# EAGLE schematic zdrive (EAGLE 9.6.2)
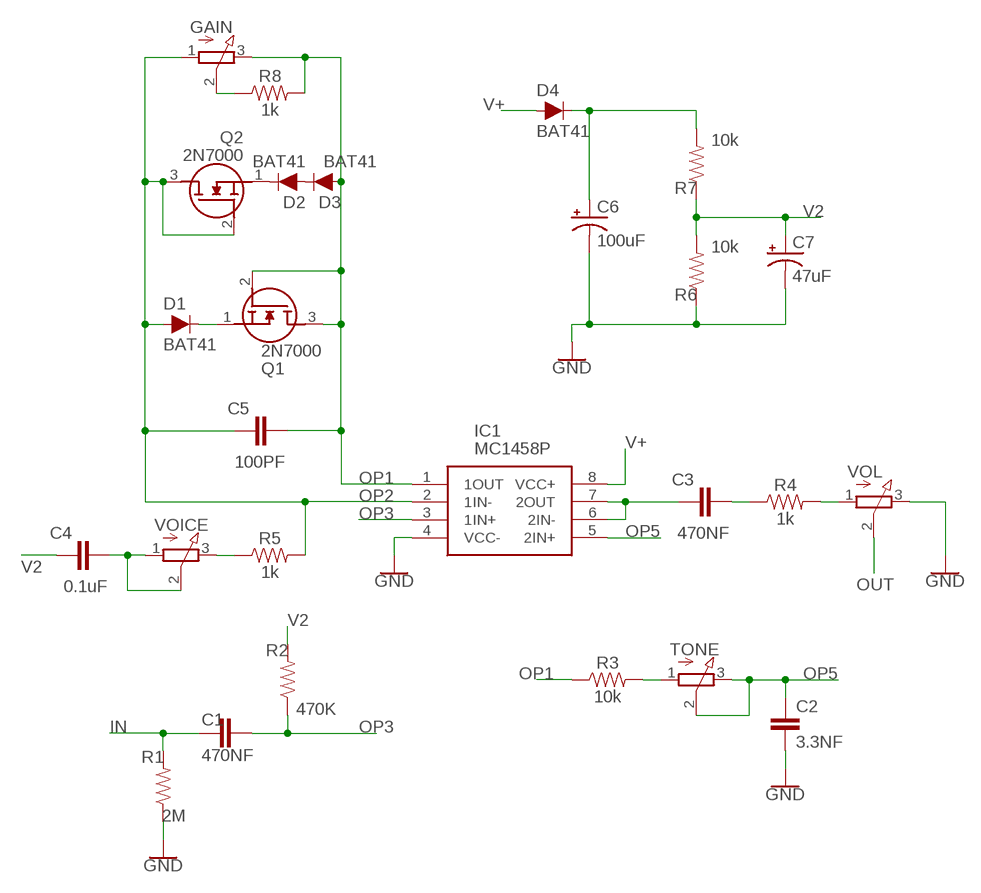
[diagram p0: schematic, sheet 1]

## Parts
C1  470NF  [CAP-PTH-SMALL-KIT]
C2  3.3NF  [CAP-PTH-SMALL-KIT]
C3  470NF  [CAP-PTH-SMALL-KIT]
C4  0.1uF  0.1UF-KIT-EZ-50V-20%  [CAP-PTH-SMALL-KIT]
C5  100PF  [CAP-PTH-SMALL-KIT]
C6  100uF  100UF-POLAR-RADIAL-2.5MM-25V-20%  [CPOL-RADIAL-2.5MM-6.5MM]
C7  47uF  47UF-POLAR-RADIAL-2.5MM-25V-20%  [CPOL-RADIAL-2.5MM-6.5MM]
D1  BAT41  DIODE-KIT2  [DIODE-1N4001-KIT]
D2  BAT41  DIODE-KIT2  [DIODE-1N4001-KIT]
D3  BAT41  DIODE-KIT2  [DIODE-1N4001-KIT]
D4  BAT41  DIODE-KIT2  [DIODE-1N4001-KIT]
GAIN  3RP/1610N  [3RP/1610N]
IC1  MC1458P  [DIP794W53P254L959H508Q8N]
Q1  2N7000  [TO-92_(TO-226)]
Q2  2N7000  [TO-92_(TO-226)]
R1  2M  2MOHM-HORIZ-1/4W-5%  [AXIAL-0.3]
R2  470K  470K-HORIZ-1/4W-5%  [AXIAL-0.3]
R3  10k  10KOHM-HORIZ-1/4W-5%  [AXIAL-0.3]
R4  1k  1KOHM-HORIZ-1/4W-5%  [AXIAL-0.3]
R5  1k  1KOHM-HORIZ-1/4W-5%  [AXIAL-0.3]
R6  10k  10KOHM-HORIZ-1/4W-5%  [AXIAL-0.3]
R7  10k  10KOHM-HORIZ-1/4W-5%  [AXIAL-0.3]
R8  1k  1KOHM-HORIZ-1/4W-5%  [AXIAL-0.3]
TONE  3RP/1610N  [3RP/1610N]
VOICE  3RP/1610N  [3RP/1610N]
VOL  3RP/1610N  [3RP/1610N]

## Nets
GND: C2.2 C6.2(-) C7.2(-) IC1.4(VCC-) R1.P$1 R6.P$1 VOL.3(E)
IN: C1.2 R1.P$2
N$1: R3.P$2 TONE.1(A)
N$2: C3.1 IC1.6(2IN-) IC1.7(2OUT)
N$3: C3.2 R4.P$1
N$4: R4.P$2 VOL.1(A)
N$5: GAIN.2(S) R8.P$1
N$6: R5.P$1 VOICE.3(E)
N$7: C4.2 VOICE.1(A) VOICE.2(S)
N$8: D1.C Q1.1(S)
N$9: D2.C Q2.1(S)
N$10: D2.A D3.C
OP1: C5.2 D3.A GAIN.3(E) IC1.1(1OUT) Q1.2(G) Q1.3(D) R3.P$1 R8.P$2
OP2: C5.1 D1.A GAIN.1(A) IC1.2(1IN-) Q2.2(G) Q2.3(D) R5.P$2
OP3: C1.1 IC1.3(1IN+) R2.P$1
OP5: C2.1 IC1.5(2IN+) TONE.2(S) TONE.3(E)
OUT: VOL.2(S)
V2: C4.1 C7.1(+) R2.P$2 R6.P$2 R7.P$1
V+: C6.1(+) D4.A D4.C IC1.8(VCC+) R7.P$2

## Library data of the parts
C1 C3 = Custom-Parts:470NF
C2 = Custom-Parts:3.3NF
C4 = SparkFun-Capacitors:0.1UF: 0.1µF ceramic capacitors A capacitor is a passive two-terminal electrical component used to store electrical energy temporarily in an electric field.; PROD_ID: CAP-08370
C5 = Custom-Parts:100PF
C6 = SparkFun-Capacitors:100UF-POLAR: 100µF polarized capacitors A capacitor is a passive two-terminal electrical component used to store electrical energy temporarily in an electric field.; PROD_ID: CAP-08439
C7 = Custom-Parts:47UF-POLAR: 47µF polarized capacitors A capacitor is a passive two-terminal electrical component used to store electrical energy temporarily in an electric field.; PROD_ID: CAP-08439
D1-D4 = SparkFun-DiscreteSemi:DIODE: Diode These are standard reverse protection diodes and small signal diodes. SparkFun Products: SparkFun SparkPunk Sound Kit <https://www.sparkfun.com/products/11177> SparkFun ESP8266 Thing <https://www.sparkfun.com/products/13231>; PROD_ID: DIO-09176; VALUE: 1A/50V/1.1V
GAIN TONE VOICE VOL = pot:3RP/1610N: 16mm Potentiometer one level Source: http://www.alphapotentiometers.net/html/16mm_pot_2.html
IC1 = SamacSys_Parts:MC1458P: General usage dual op-amp,MC1458P DIP8 Texas Instruments MC1458P, Dual Op Amp, 1MHz, 8-Pin PDIP Source: Datasheet <http://www.ti.com/lit/ds/symlink/mc1458.pdf>; DESCRIPTION: General usage dual op-amp,MC1458P DIP8 Texas Instruments MC1458P, Dual Op Amp, 1MHz, 8-Pin PDIP; HEIGHT: 5.08mm; MANUFACTURER_NAME: Texas Instruments; MANUFACTURER_PART_NUMBER: MC1458P; MOUSER_PART_NUMBER: 595-MC1458P; MOUSER_PRICE-STOCK: https://www.mouser.co.uk/ProductDetail/Texas-Instruments/MC1458P?qs=YhsVCygOPE1MedllaWxE%252BA%3D%3D
Q1 Q2 = SamacSys_Parts:2N7000: N-channel MOSFET,2N7000 0.2A 60V Source: Datasheet <http://www.onsemi.com/pub/Collateral/NDS7002A-D.PDF>; DESCRIPTION: N-channel MOSFET,2N7000 0.2A 60V; HEIGHT: mm; MANUFACTURER_NAME: ON Semiconductor; MANUFACTURER_PART_NUMBER: 2N7000; MOUSER_PART_NUMBER: 512-2N7000; MOUSER_PRICE-STOCK: https://www.mouser.co.uk/ProductDetail/ON-Semiconductor-Fairchild/2N7000/?qs=FOlmdCx%252BAA2o%2FKZOTk%2F3hg%3D%3D
R1 = Custom-Parts:2MOHM: 2MΩ resistor A resistor is a passive two-terminal electrical component that implements electrical resistance as a circuit element. Resistors act to reduce current flow, and, at the same time, act to lower voltage levels within circuits. - Wikipedia; PROD_ID: RES-09329
R2 = Custom-Parts:470K: 470KΩ resistor A resistor is a passive two-terminal electrical component that implements electrical resistance as a circuit element. Resistors act to reduce current flow, and, at the same time, act to lower voltage levels within circuits. - Wikipedia; PROD_ID: RES-09329
R3 R6 R7 = SparkFun-Resistors:10KOHM: 10kΩ resistor A resistor is a passive two-terminal electrical component that implements electrical resistance as a circuit element. Resistors act to reduce current flow, and, at the same time, act to lower voltage levels within circuits. - Wikipedia; PROD_ID: RES-09435
R4 R5 R8 = SparkFun-Resistors:1KOHM: 1kΩ resistor A resistor is a passive two-terminal electrical component that implements electrical resistance as a circuit element. Resistors act to reduce current flow, and, at the same time, act to lower voltage levels within circuits. - Wikipedia; PROD_ID: RES-08380